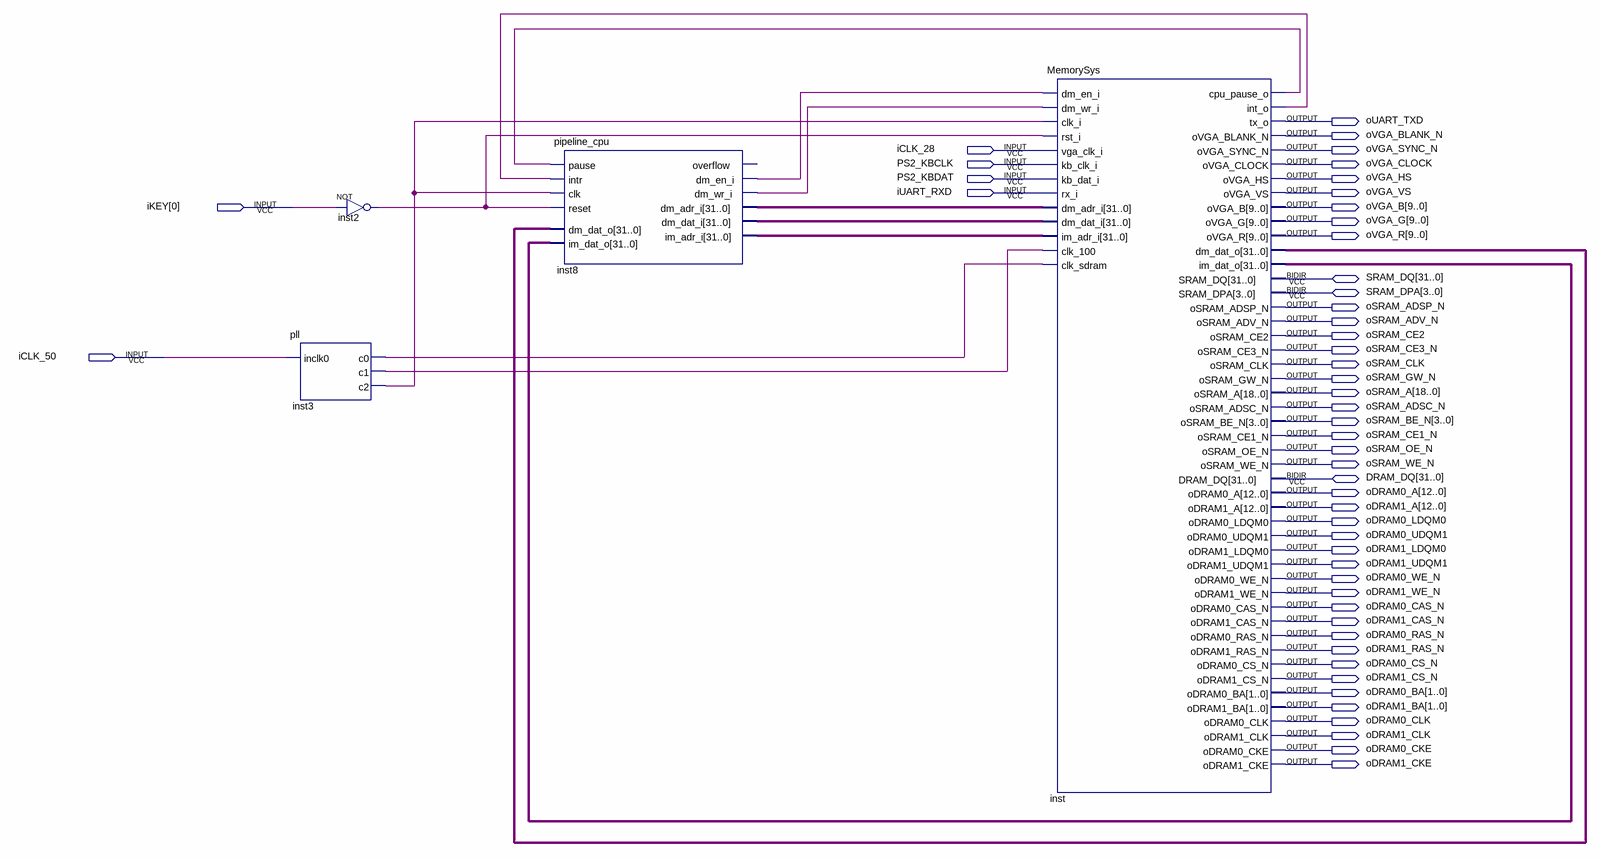
[diagram p0: schematic sheet]
// Quartus schematic CPU.bdf as structural Verilog: 4 symbols, 50 pins
module CPU (
  input  iCLK_28,
  input  PS2_KBCLK,
  input  PS2_KBDAT,
  input  iUART_RXD,
  input  [0:0] iKEY,
  input  iCLK_50,
  inout  [31:0] SRAM_DQ,
  inout  [3:0] SRAM_DPA,
  inout  [31:0] DRAM_DQ,
  output oUART_TXD,
  output oVGA_BLANK_N,
  output oVGA_SYNC_N,
  output oVGA_CLOCK,
  output oVGA_HS,
  output oVGA_VS,
  output [9:0] oVGA_B,
  output [9:0] oVGA_G,
  output [9:0] oVGA_R,
  output oSRAM_ADSP_N,
  output oSRAM_ADV_N,
  output oSRAM_CE2,
  output oSRAM_CE3_N,
  output oSRAM_CLK,
  output oSRAM_GW_N,
  output [18:0] oSRAM_A,
  output oSRAM_ADSC_N,
  output [3:0] oSRAM_BE_N,
  output oSRAM_CE1_N,
  output oSRAM_OE_N,
  output oSRAM_WE_N,
  output [12:0] oDRAM0_A,
  output [12:0] oDRAM1_A,
  output oDRAM0_LDQM0,
  output oDRAM0_UDQM1,
  output oDRAM1_LDQM0,
  output oDRAM1_UDQM1,
  output oDRAM0_WE_N,
  output oDRAM1_WE_N,
  output oDRAM0_CAS_N,
  output oDRAM1_CAS_N,
  output oDRAM0_RAS_N,
  output oDRAM1_RAS_N,
  output oDRAM0_CS_N,
  output oDRAM1_CS_N,
  output [1:0] oDRAM0_BA,
  output [1:0] oDRAM1_BA,
  output oDRAM0_CLK,
  output oDRAM1_CLK,
  output oDRAM0_CKE,
  output oDRAM1_CKE
);

  wire inst2_out, inst3_c0, inst3_c1, inst3_c2, inst8_dm_en_i, inst8_dm_wr_i, inst_cpu_pause_o, inst_int_o;
  wire [31:0] inst8_dm_adr_i, inst8_dm_dat_i, inst8_im_adr_i, inst_dm_dat_o, inst_im_dat_o;

  pll inst3 (.inclk0(iCLK_50), .c0(inst3_c0), .c1(inst3_c1), .c2(inst3_c2));
  not inst2 (inst2_out, iKEY[0]);
  pipeline_cpu inst8 (
    .pause(inst_cpu_pause_o), .intr(inst_int_o), .dm_dat_o(inst_dm_dat_o), .im_dat_o(inst_im_dat_o),
    .clk(inst3_c2), .reset(inst2_out), .dm_en_i(inst8_dm_en_i), .dm_wr_i(inst8_dm_wr_i),
    .dm_adr_i(inst8_dm_adr_i), .dm_dat_i(inst8_dm_dat_i), .im_adr_i(inst8_im_adr_i));  // open: overflow
  MemorySys inst (
    .dm_en_i(inst8_dm_en_i), .dm_wr_i(inst8_dm_wr_i), .clk_i(inst3_c2), .rst_i(inst2_out),
    .vga_clk_i(iCLK_28), .kb_clk_i(PS2_KBCLK), .kb_dat_i(PS2_KBDAT), .rx_i(iUART_RXD),
    .dm_adr_i(inst8_dm_adr_i), .dm_dat_i(inst8_dm_dat_i), .im_adr_i(inst8_im_adr_i), .clk_100(inst3_c1),
    .clk_sdram(inst3_c0), .cpu_pause_o(inst_cpu_pause_o), .int_o(inst_int_o), .tx_o(oUART_TXD),
    .oVGA_BLANK_N(oVGA_BLANK_N), .oVGA_SYNC_N(oVGA_SYNC_N), .oVGA_CLOCK(oVGA_CLOCK), .oVGA_HS(oVGA_HS),
    .oVGA_VS(oVGA_VS), .oVGA_B(oVGA_B), .oVGA_G(oVGA_G), .oVGA_R(oVGA_R), .dm_dat_o(inst_dm_dat_o),
    .im_dat_o(inst_im_dat_o), .oSRAM_ADSP_N(oSRAM_ADSP_N), .oSRAM_ADV_N(oSRAM_ADV_N), .oSRAM_CE2(oSRAM_CE2),
    .oSRAM_CE3_N(oSRAM_CE3_N), .oSRAM_CLK(oSRAM_CLK), .oSRAM_GW_N(oSRAM_GW_N), .oSRAM_A(oSRAM_A),
    .oSRAM_ADSC_N(oSRAM_ADSC_N), .oSRAM_BE_N(oSRAM_BE_N), .oSRAM_CE1_N(oSRAM_CE1_N), .oSRAM_OE_N(oSRAM_OE_N),
    .oSRAM_WE_N(oSRAM_WE_N), .oDRAM0_A(oDRAM0_A), .oDRAM1_A(oDRAM1_A), .oDRAM0_LDQM0(oDRAM0_LDQM0),
    .oDRAM0_UDQM1(oDRAM0_UDQM1), .oDRAM1_LDQM0(oDRAM1_LDQM0), .oDRAM1_UDQM1(oDRAM1_UDQM1),
    .oDRAM0_WE_N(oDRAM0_WE_N), .oDRAM1_WE_N(oDRAM1_WE_N), .oDRAM0_CAS_N(oDRAM0_CAS_N),
    .oDRAM1_CAS_N(oDRAM1_CAS_N), .oDRAM0_RAS_N(oDRAM0_RAS_N), .oDRAM1_RAS_N(oDRAM1_RAS_N),
    .oDRAM0_CS_N(oDRAM0_CS_N), .oDRAM1_CS_N(oDRAM1_CS_N), .oDRAM0_BA(oDRAM0_BA), .oDRAM1_BA(oDRAM1_BA),
    .oDRAM0_CLK(oDRAM0_CLK), .oDRAM1_CLK(oDRAM1_CLK), .oDRAM0_CKE(oDRAM0_CKE), .oDRAM1_CKE(oDRAM1_CKE),
    .SRAM_DQ(SRAM_DQ), .SRAM_DPA(SRAM_DPA), .DRAM_DQ(DRAM_DQ));
endmodule
